# Altium schematic sheet KF350-3.5-3P.schdoc
size 127 x 101 mm
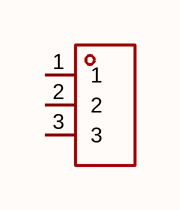
[diagram p0: KF350-3.5-3P.schdoc]

## Parts
U?  kf350-3.5-3p  [CONN-TH_3P-P3.50_KF350-3.5-3P]  (value not drawn)

## Nets

Not connected (* = marked no-connect by the designer): U? 1 2 3

## Library data of the parts
U? = kf350-3.5-3p: 结构:1x3P;间距:3.5mm;颜色:绿色;安装方式:直插;排数:1;每排PIN数:3;额定电流:10A;额定电压:300V;线规 - AWG:18~24;线规 - 平方毫米:0.75;工作温度:-40℃~+105℃;; Manufacturer: KEFA(科发); AddInBom: yes; ModelId: 66d6ea4170124c3f83d623ee30815f83; ModelTransform: 444.881,271.653,0,0,0,0,-0.005,1.969,-137.795; Number of Positions or Pins: 1x3P; Pitch: 3.5mm; Number of PINs Per Row: 3; Current Rating: 10A; Voltage Rating (Max): 300V; Wire Gauge - AWG: 18~24; Wire Gauge - mm2: 0.75; Symbol: KF350-3.5-3P; LCSC Part Name: 1x3P 3.5mm 直插 排数:1 每排P数:3; SupplierPart: C474893; ManufacturerPart: KF350-3.5-3P; Supplier Footprint: 插件,P=3.5mm; JLCPCB Part Class: Extended Part; Datasheet: https://item.szlcsc.com/datasheet/KF350-3.5-3P/481511.html; Supplier: LCSC; ConvertToPcb: yes; FootprintName: CONN-TH_3P-P3.50_KF350-3.5-3P; ModelName: CONN-TH_3P-P3.50_KF350-3.5-3P; Color: 绿色; Mounting Type: 直插; Number of Pins: 3P; Number of Rows: 1; Operating Temperature: -40℃~+105℃